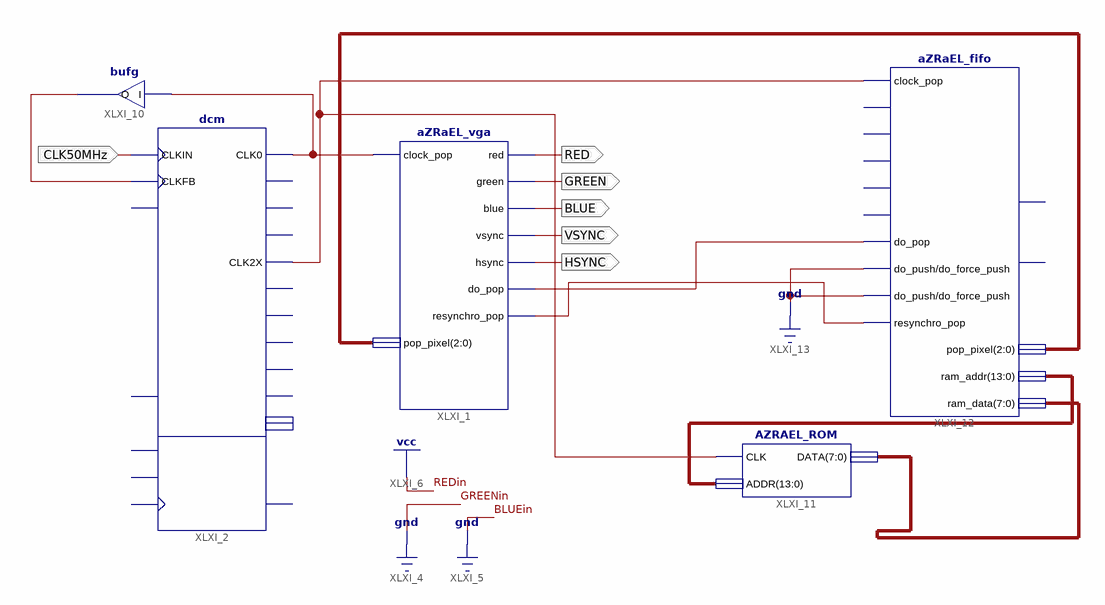
[diagram p0: schematic sheet 1]
// Xilinx ISE schematic aZRaEL.sch (spartan3) as structural Verilog: 5 symbols, 6 ports
module aZRaEL (
  input  CLK50MHz,
  output RED,
  output GREEN,
  output BLUE,
  output VSYNC,
  output HSYNC
);

  wire XLXN_18, XLXN_23, XLXN_32, XLXN_33, XLXN_34;
  wire [2:0] XLXN_28;
  wire [7:0] XLXN_20;
  wire [13:0] XLXN_29;

  aZRaEL_vga XLXI_1 (
    .clock_pop(XLXN_33), .pop_pixel(XLXN_28), .red(RED), .green(GREEN), .blue(BLUE), .vsync(VSYNC),
    .hsync(HSYNC), .do_pop(XLXN_23), .resynchro_pop(XLXN_32));
  dcm #(.CLKIN_DIVIDE_BY_2("TRUE")) XLXI_2 (
    .CLKFB(XLXN_18), .CLKIN(CLK50MHz), .CLK0(XLXN_33), .CLK2X(XLXN_34));  // open: DSSEN, PSCLK, PSEN, PSINCDEC, RST, CLK180, CLK270, CLK2X180, CLK90, CLKDV, CLKFX, CLKFX180, LOCKED, PSDONE, STATUS
  bufg XLXI_10 (.I(XLXN_33), .O(XLXN_18));
  AZRAEL_ROM XLXI_11 (.CLK(XLXN_34), .ADDR(XLXN_29), .DATA(XLXN_20));
  aZRaEL_fifo XLXI_12 (
    .clock_pop(XLXN_34), .do_pop(XLXN_23), .do_push(1'b0), .do_force_push(1'b0), .resynchro_pop(XLXN_32),
    .ram_data(XLXN_20), .pop_pixel(XLXN_28), .ram_addr(XLXN_29));  // open: clock_push, clock_force_push, push_pixel, force_push_pixel, force_addr, ram_write, ram_read
endmodule
